# EAGLE schematic Schematic (EAGLE 6.4)
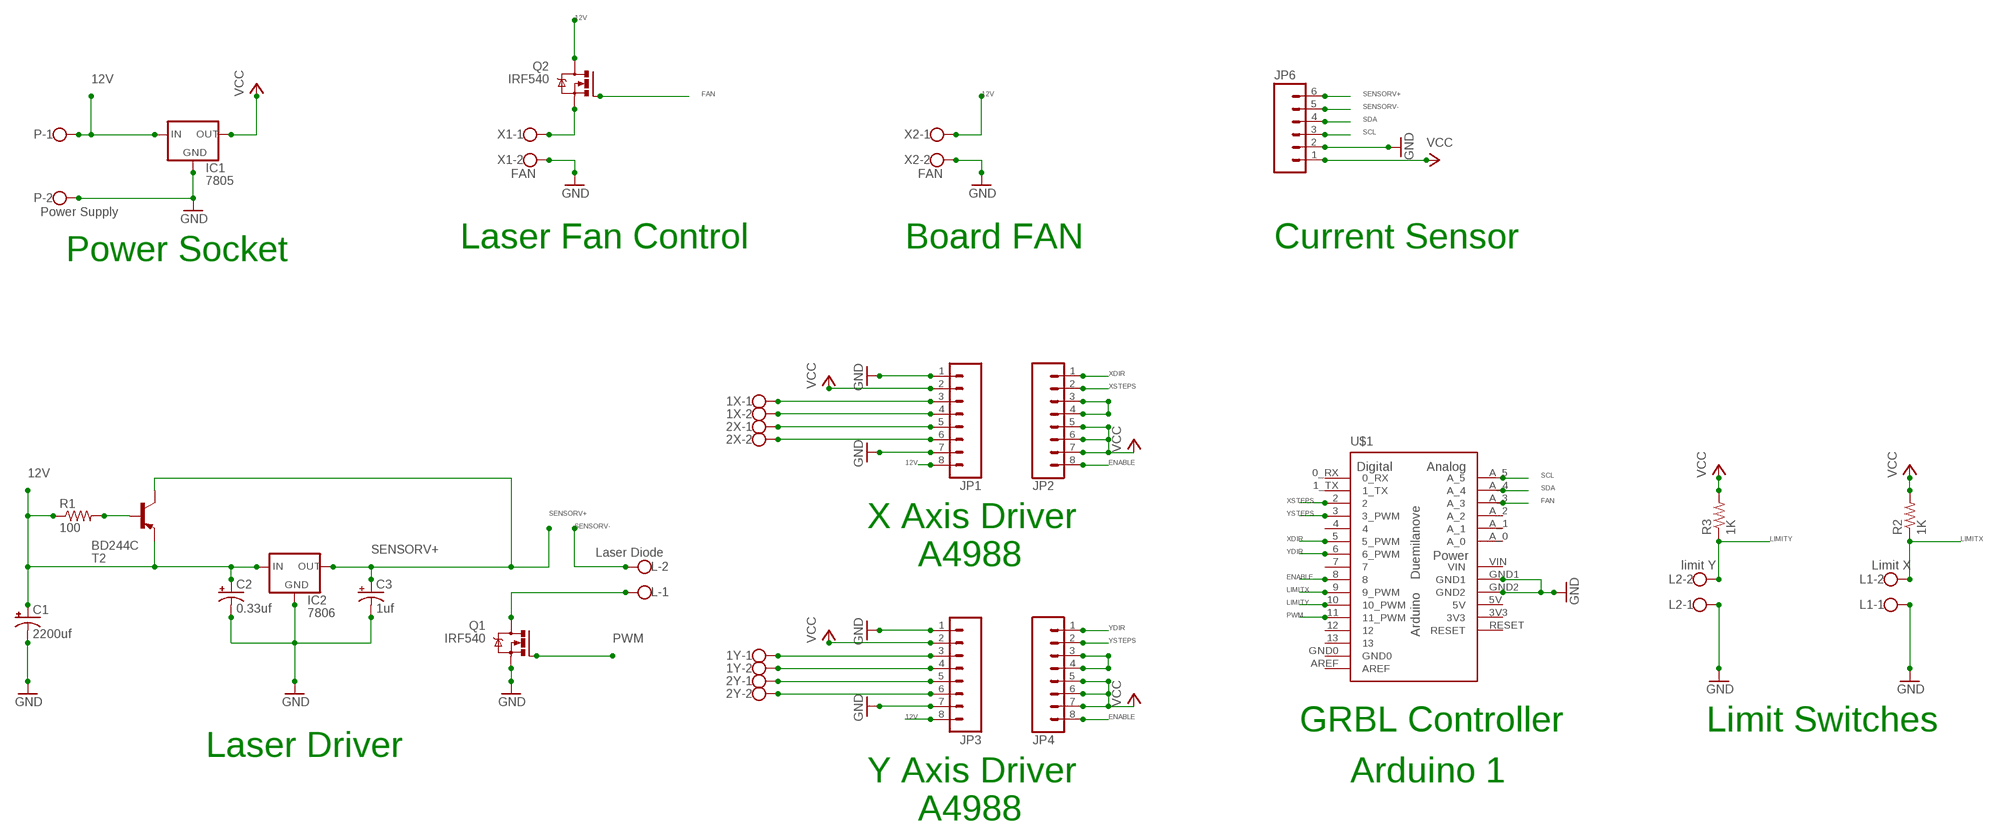
[diagram p0: schematic, sheet 1]

## Parts
1X  W237-102  [W237-102]
1Y  W237-102  [W237-102]
2X  W237-102  [W237-102]
2Y  W237-102  [W237-102]
C1  2200uf  CAP_POLPTH4  [CPOL-RADIAL-1000UF-25V]
C2  0.33uf  CAP_POLPTH2  [CPOL-RADIAL-10UF-25V]
C3  1uf  CAP_POLPTH2  [CPOL-RADIAL-10UF-25V]
IC1  7805  V_REG_78XXSINK  [TO220-IGO]
IC2  7806  V_REG_78XXSINK  [TO220-IGO]
JP1  M08  [1X08]
JP2  M08  [1X08]
JP3  M08  [1X08]
JP4  M08  [1X08]
JP6  M06LONGPADS  [1X06_LONGPADS]
L  Laser Diode  W237-102  [W237-102]
L1  Limit X  W237-102  [W237-102]
L2  limit Y  W237-102  [W237-102]
P  Power Supply  W237-102  [W237-102]
Q1  IRF540  [TO220BV]
Q2  IRF540  [TO220BV]
R1  100  RESISTORPTH-1/6W  [1/6W-RES]
R2  1K  RESISTORPTH-1/6W  [1/6W-RES]
R3  1K  RESISTORPTH-1/6W  [1/6W-RES]
T2  BD244C  -PNP-TO220V  [TO220V]
U$1  ARDUINO-USBLONG_PADS_TEXT  [SHIELD]
X1  FAN  W237-102  [W237-102]
X2  FAN  W237-102  [W237-102]

## Nets
12V: C1.1(+) C2.1(+) IC1.IN IC2.IN JP1.8 JP3.8 P.1 Q2.D R1.1 T2.3(E) X2.1
ENABLE: JP2.8 JP4.8 U$1.8
FAN: Q2.G U$1.A_3
GND: C1.2(-) C2.2(-) C3.2(-) IC1.GND IC2.GND JP1.1 JP1.7 JP3.1 JP3.7 JP6.2 L1.1 L2.1 P.2 Q1.S U$1.GND1 U$1.GND2 X1.2 X2.2
LIMITX: L1.2 R2.1 U$1.9(9_PWM)
LIMITY: L2.2 R3.1 U$1.10(10_PWM)
N$1: L.1 Q1.D
N$2: R1.2 T2.1(B)
N$28: 1X.1 JP1.3
N$29: 1X.2 JP1.4
N$30: 2X.1 JP1.5
N$31: 2X.2 JP1.6
N$33: Q2.S X1.1
N$35: JP2.3 JP2.4
N$43: JP4.3 JP4.4
N$48: 1Y.1 JP3.3
N$49: 1Y.2 JP3.4
N$50: 2Y.1 JP3.5
N$51: 2Y.2 JP3.6
PWM: Q1.G U$1.11(11_PWM)
SCL: JP6.3 U$1.A_5
SDA: JP6.4 U$1.A_4
SENSORV+: C3.1(+) IC2.OUT JP6.6 T2.2(C)
SENSORV-: JP6.5 L.2
VCC: IC1.OUT JP1.2 JP2.5 JP2.6 JP2.7 JP3.2 JP4.5 JP4.6 JP4.7 JP6.1 R2.2 R3.2
XDIR: JP2.1 U$1.5(5_PWM)
XSTEPS: JP2.2 U$1.2
YDIR: JP4.1 U$1.6(6_PWM)
YSTEPS: JP4.2 U$1.3(3_PWM)
Unconnected: U$1.0_RX U$1.1_TX U$1.4 U$1.7 U$1.12 U$1.13 U$1.A_0 U$1.A_1 U$1.A_2 U$1.AREF U$1.GND0 U$1.RESET

## Notes on the sheet
- Laser Fan Control | Board FAN | Current Sensor
- Power Socket
- X Axis Driver
- A4988
- GRBL Controller | Limit Switches
- Laser Driver
- Y Axis Driver | Arduino 1
- A4988

## Power pins joined to a net without a drawn wire
3V3: U$1.3V3
5V: U$1.5V
VIN: U$1.VIN

## Library data of the parts
1X 1Y 2X 2Y L L1 L2 P X1 X2 = con-wago-500:W237-102: WAGO SCREW CLAMP; MPN: 237-102; OC_FARNELL: unknown; OC_NEWARK: 70K9898
C1-C3 = 01_SparkFun:CAP_POL: Capacitor Polarized These are standard SMD and PTH capacitors. Normally 10uF, 47uF, and 100uF in electrolytic and tantalum varieties. Always verify the external diameter of the through hole cap, it varies with capacity, voltage, and manufacturer. The EIA devices should be standard.
IC1 IC2 = 01_SparkFun:V_REG_78XX: Voltage Regulator Standard 7805 5V regulator. IGO (Input Ground Output). Spark Fun Electronics SKU : COM-00107
JP1-JP4 = 01_SparkFun:M08: Header 8 Standard 8-pin 0.1" header. Use with straight break away headers (SKU : PRT-00116), right angle break away headers (PRT-00553), swiss pins (PRT-00743), machine pins (PRT-00117), and female headers (PRT-00115).
JP6 = 01_SparkFun:M06: Header 6 Standard 6-pin 0.1" header. Use with straight break away headers (SKU : PRT-00116), right angle break away headers (PRT-00553), swiss pins (PRT-00743), machine pins (PRT-00117), and female headers (PRT-00115). Molex polarized connector foot print use with SKU : PRT-08094 with associated crimp pins and housings. NOTES ON THE VARIANTS LOCK and LOCK_LONGPADS... This footprint was designed to help hold the alignment of a through-hole component (i.e. 6-pin header) while soldering it into place. You may notice that each hole has been shifted either up or down by 0.005 of an inch from it's more standard position (which is a perfectly straight line). This slight alteration caused the pins (the squares in the middle) to touch the edges of the holes. Because they are alternating, it causes a "brace" to hold the component in place. 0.005 has proven to be the perfect amount of "off-center" position when using our standard breakaway headers. Although looks a little odd when you look at the bare footprint, once you have a header in there, the alteration is very hard to notice. Also, if you push a header all the way into place, it is covered up entirely on the bottom side. This idea of altering the position of holes to aid alignment will be further integrated into the Sparkfun Library for other footprints. It can help hold any component with 3 or more connection pins.
Q1 Q2 = transistor-power:IRF540: HEXFET Power MOSFET
R1-R3 = 01_SparkFun:RESISTOR: Resistor Basic schematic elements and footprints for 0603, 1206, and PTH 1/10th watt (small) resistors.
T2 = transistor:*-PNP-: PNP Transistror
U$1 = 01_Arduino-Various:ARDUINO-USB: The Ardiuno Duemilanove Pinouts layoutet as a Bare Shield. v0.5 Also for Arduino Diecimila. This is designed as a Part and has no Outline in the Dimension Layer. The Outline, when present, is drawed at the tPlace / bPlace Layer. Library by Stephanie Lange, http://www.k-ita.de/~sl/